# EAGLE schematic untitled (EAGLE 8.4.3)
ESP Devkit-C Shield
CNAME: ESP32-DEVKIT SHIELD DESIGN; CREVISION: 1.0; DESIGNER: EREN MERT IREZ
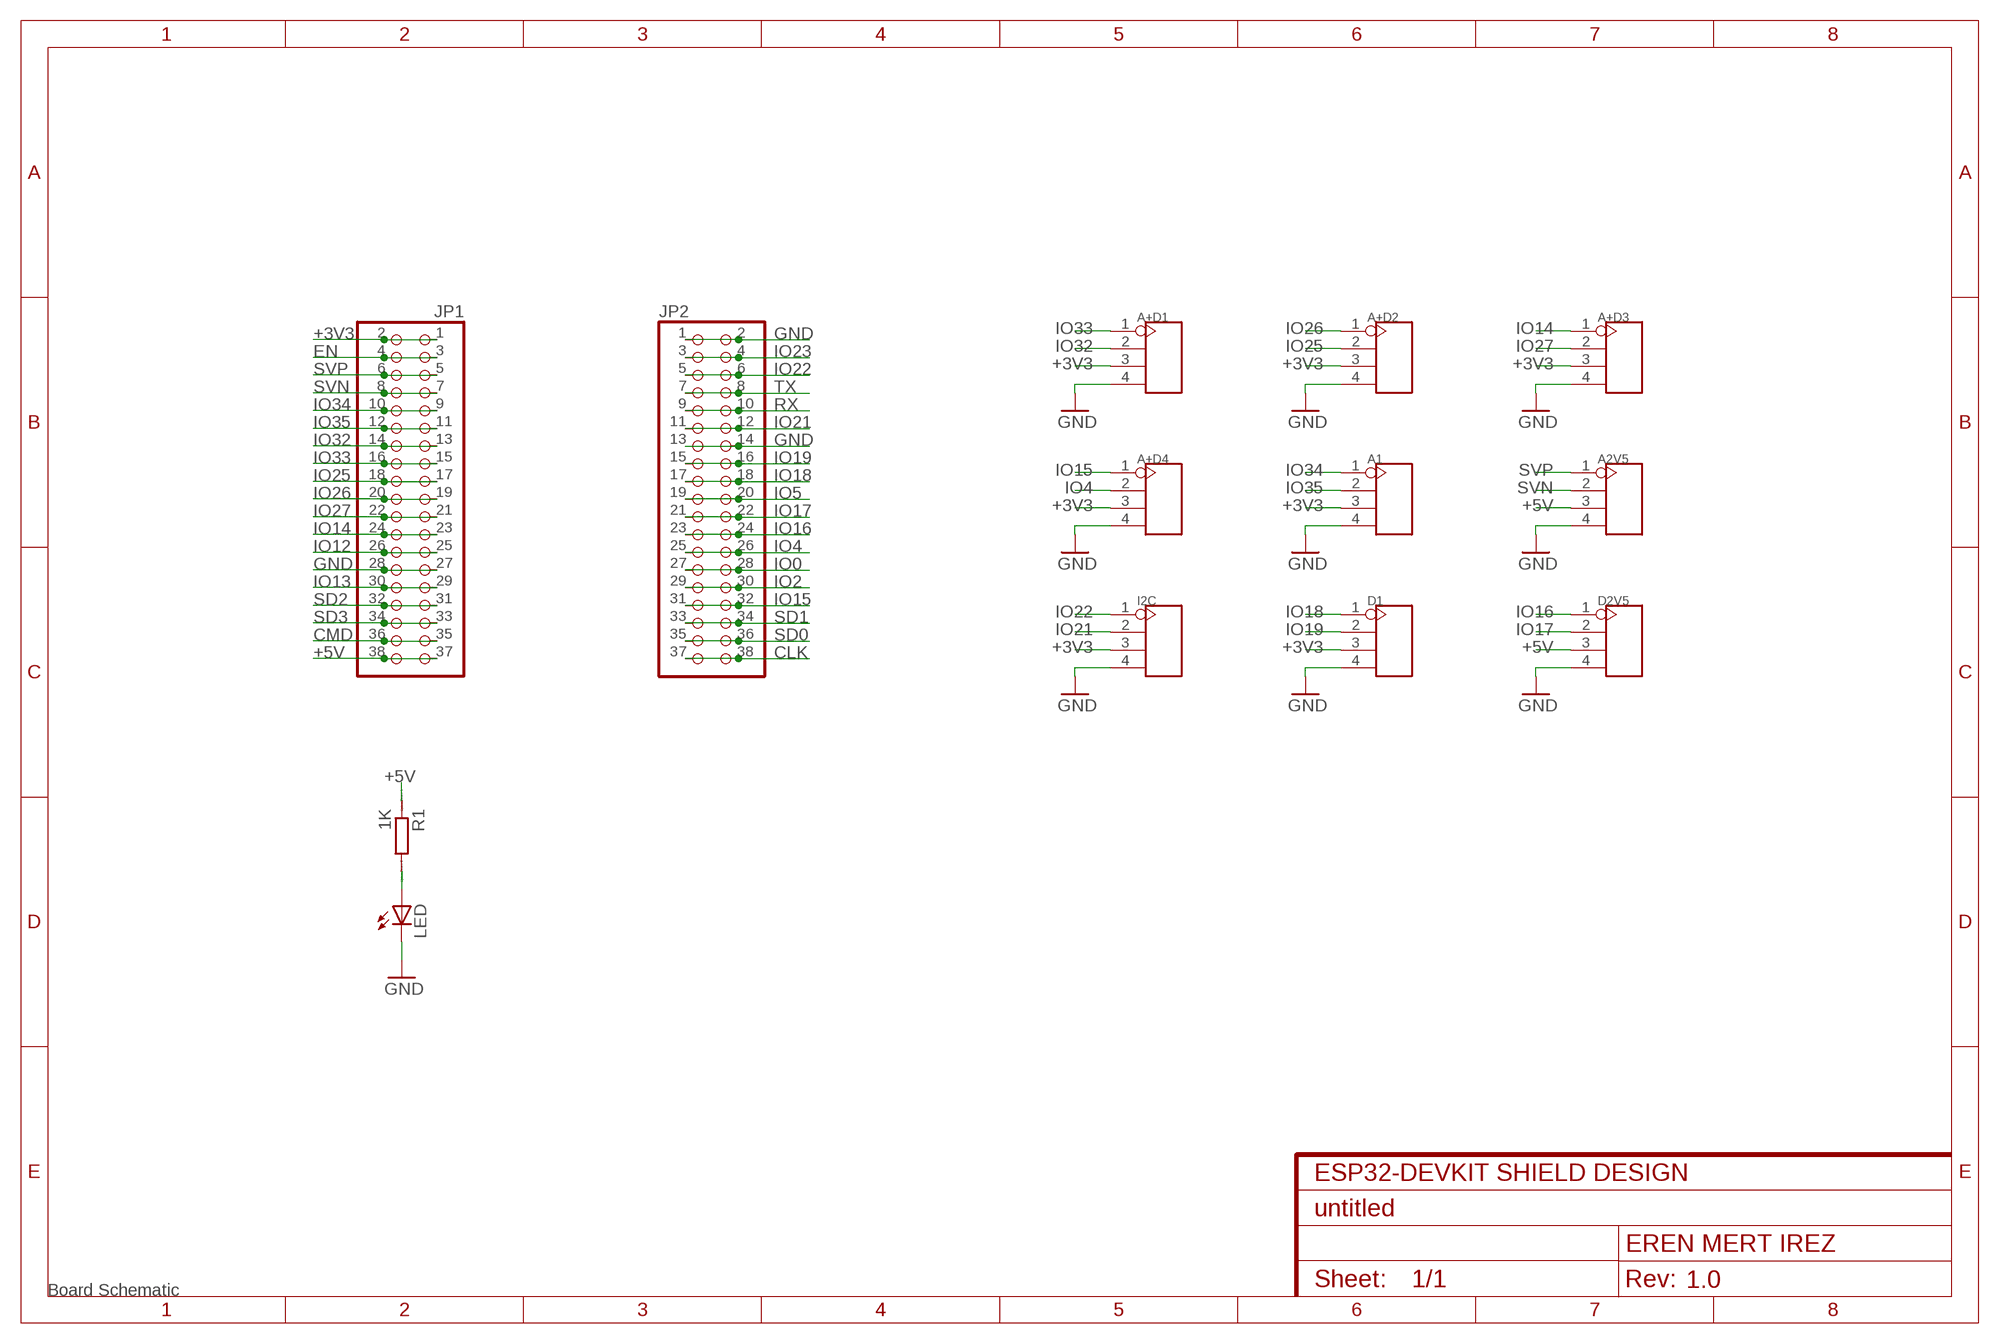
[diagram p0: schematic, sheet 1]
FRAME1 (FRAME-A4L): UNTITLED: Board Schematic

## Parts
A1  HEADER-4P-80/40MIL  [4P-2.54-80/40MIL]
A2V5  HEADER-4P-80/40MIL  [4P-2.54-80/40MIL]
A+D1  HEADER-4P-80/40MIL  [4P-2.54-80/40MIL]
A+D2  HEADER-4P-80/40MIL  [4P-2.54-80/40MIL]
A+D3  HEADER-4P-80/40MIL  [4P-2.54-80/40MIL]
A+D4  HEADER-4P-80/40MIL  [4P-2.54-80/40MIL]
D1  HEADER-4P-80/40MIL  [4P-2.54-80/40MIL]
D2V5  HEADER-4P-80/40MIL  [4P-2.54-80/40MIL]
I2C  HEADER-4P-80/40MIL  [4P-2.54-80/40MIL]
JP1  PINHD-2X19  [2X19]
JP2  PINHD-2X19  [2X19]
LED  LED3MM  [LED3MM]
R1  1K  R0207/10  [0207/10]

## Nets
+3V3: A1.3 A+D1.3 A+D2.3 A+D3.3 A+D4.3 D1.3 I2C.3 JP1.1 JP1.2
+5V: A2V5.3 D2V5.3 JP1.37 JP1.38 R1.1
CLK: JP2.37 JP2.38
CMD: JP1.35 JP1.36
CRC: LED.A R1.2
EN: JP1.3 JP1.4
GND: A1.4 A2V5.4 A+D1.4 A+D2.4 A+D3.4 A+D4.4 D1.4 D2V5.4 I2C.4 JP1.27 JP1.28 JP2.1 JP2.2 JP2.13 JP2.14 LED.K(C)
IO0: JP2.27 JP2.28
IO2: JP2.29 JP2.30
IO4: A+D4.2 JP2.25 JP2.26
IO5: JP2.19 JP2.20
IO12: JP1.25 JP1.26
IO13: JP1.29 JP1.30
IO14: A+D3.1 JP1.23 JP1.24
IO15: A+D4.1 JP2.31 JP2.32
IO16: D2V5.1 JP2.23 JP2.24
IO17: D2V5.2 JP2.21 JP2.22
IO18: D1.1 JP2.17 JP2.18
IO19: D1.2 JP2.15 JP2.16
IO21: I2C.2 JP2.11 JP2.12
IO22: I2C.1 JP2.5 JP2.6
IO23: JP2.3 JP2.4
IO25: A+D2.2 JP1.17 JP1.18
IO26: A+D2.1 JP1.19 JP1.20
IO27: A+D3.2 JP1.21 JP1.22
IO32: A+D1.2 JP1.13 JP1.14
IO33: A+D1.1 JP1.15 JP1.16
IO34: A1.1 JP1.9 JP1.10
IO35: A1.2 JP1.11 JP1.12
RX: JP2.9 JP2.10
SD0: JP2.35 JP2.36
SD1: JP2.33 JP2.34
SD2: JP1.31 JP1.32
SD3: JP1.33 JP1.34
SVN: A2V5.2 JP1.7 JP1.8
SVP: A2V5.1 JP1.5 JP1.6
TX: JP2.7 JP2.8

## Library data of the parts
A1 A2V5 A+D1-A+D4 D1 D2V5 I2C = connector:HEADER-4P
JP1 JP2 = pinhead:PINHD-2X19: PIN HEADER
LED = led:LED: LED OSRAM: - CHIPLED LG R971, LG N971, LY N971, LG Q971, LY Q971, LO R971, LY R971 LH N974, LH R974 LS Q976, LO Q976, LY Q976 LO Q996 - Hyper CHIPLED LW Q18S LB Q993, LB Q99A, LB R99A - SideLED LS A670, LO A670, LY A670, LG A670, LP A670 LB A673, LV A673, LT A673, LW A673 LH A674 LY A675 LS A676, LA A676, LO A676, LY A676, LW A676 LS A679, LY A679, LG A679 - Hyper Micro SIDELED® LS Y876, LA Y876, LO Y876, LY Y876 LT Y87S - SmartLED LW L88C, LW L88S LB L89C, LB L89S, LG L890 LS L89K, LO L89K, LY L89K LS L896, LA L896, LO L896, LY L896 - TOPLED LS T670, LO T670, LY T670, LG T670, LP T670 LSG T670, LSP T670, LSY T670, LOP T670, LYG T670 LG T671, LOG T671, LSG T671 LB T673, LV T673, LT T673, LW T673 LH T674 LS T676, LA T676, LO T676, LY T676, LB T676, LH T676, LSB T676, LW T676 LB T67C, LV T67C, LT T67C, LS T67K, LO T67K, LY T67K, LW E67C LS E67B, LA E67B, LO E67B, LY E67B, LB E67C, LV E67C, LT E67C LW T67C LS T679, LY T679, LG T679 LS T770, LO T770, LY T770, LG T770, LP T770 LB T773, LV T773, LT T773, LW T773 LH T774 LS E675, LA E675, LY E675, LS T675 LS T776, LA T776, LO T776, LY T776, LB T776 LHGB T686 LT T68C, LB T68C - Hyper Mini TOPLED® LB M676 - Mini TOPLED Santana® LG M470 LS M47K, LO M47K, LY M47K Source: http://www.osram.convergy.de LUXEON: - LUMILED® LXK2-PW12-R00, LXK2-PW12-S00, LXK2-PW14-U00, LXK2-PW14-V00 LXK2-PM12-R00, LXK2-PM12-S00, LXK2-PM14-U00 LXK2-PE12-Q00, LXK2-PE12-R00, LXK2-PE12-S00, LXK2-PE14-T00, LXK2-PE14-U00 LXK2-PB12-K00, LXK2-PB12-L00, LXK2-PB12-M00, LXK2-PB14-N00, LXK2-PB14-P00, LXK2-PB14-Q00 LXK2-PR12-L00, LXK2-PR12-M00, LXK2-PR14-Q00, LXK2-PR14-R00 LXK2-PD12-Q00, LXK2-PD12-R00, LXK2-PD12-S00 LXK2-PH12-R00, LXK2-PH12-S00 LXK2-PL12-P00, LXK2-PL12-Q00, LXK2-PL12-R00 Source: www.luxeon.com KINGBRIGHT: KA-3528ASYC Source: www.kingbright.com
R1 = eagle-ltspice:R: RESISTOR, European symbol; SPICEMODEL: NONE; SPICEPREFIX: R